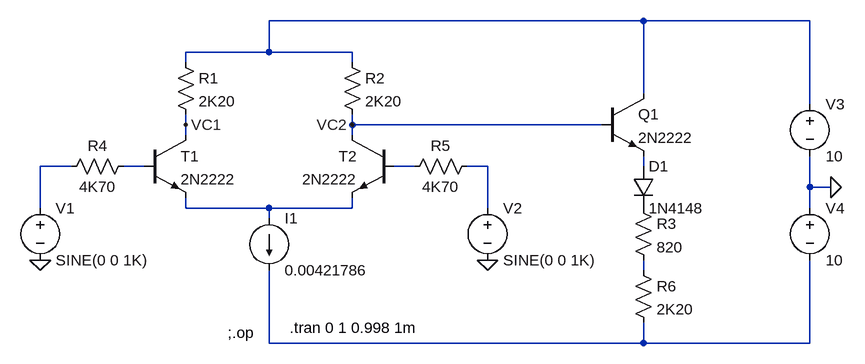
[diagram p0: schematic Prelab 2.asc]
Prelab 2.asc, the LTspice schematic file:
Version 4
SHEET 1 1144 680
WIRE 832 -48 256 -48
WIRE 1088 -48 832 -48
WIRE 256 0 256 -48
WIRE 256 0 128 0
WIRE 384 0 256 0
WIRE 128 16 128 0
WIRE 384 16 384 0
WIRE 832 64 832 -48
WIRE 1088 80 1088 -48
WIRE 128 112 128 96
WIRE 384 112 384 96
WIRE 768 112 384 112
WIRE 128 128 128 112
WIRE 384 128 384 112
WIRE -48 176 -96 176
WIRE 64 176 32 176
WIRE 480 176 448 176
WIRE 592 176 560 176
WIRE 832 176 832 160
WIRE 1088 208 1088 160
WIRE 1120 208 1088 208
WIRE -96 240 -96 176
WIRE 128 240 128 224
WIRE 256 240 128 240
WIRE 384 240 384 224
WIRE 384 240 256 240
WIRE 592 240 592 176
WIRE 1088 240 1088 208
WIRE 256 256 256 240
WIRE 832 336 832 320
WIRE 256 448 256 336
WIRE 832 448 832 416
WIRE 832 448 256 448
WIRE 1088 448 1088 320
WIRE 1088 448 832 448
FLAG -96 320 0
FLAG 592 320 0
FLAG 1120 208 0
FLAG 384 112 VC2
FLAG 128 112 VC1
SYMBOL res 112 0 R0
SYMATTR InstName R1
SYMATTR Value 2K20
SYMBOL res 368 0 R0
SYMATTR InstName R2
SYMATTR Value 2K20
SYMBOL res 48 160 R90
WINDOW 0 0 56 VBottom 2
WINDOW 3 32 56 VTop 2
SYMATTR InstName R4
SYMATTR Value 4K70
SYMBOL res 576 160 R90
WINDOW 0 0 56 VBottom 2
WINDOW 3 32 56 VTop 2
SYMATTR InstName R5
SYMATTR Value 4K70
SYMBOL npn 64 128 R0
SYMATTR InstName T1
SYMATTR Value 2N2222
SYMBOL npn 448 128 M0
SYMATTR InstName T2
SYMATTR Value 2N2222
SYMBOL voltage -96 224 R0
WINDOW 123 0 0 Left 0
WINDOW 39 0 0 Left 0
SYMATTR InstName V1
SYMATTR Value SINE(0 0 1K)
SYMBOL voltage 592 224 R0
WINDOW 123 0 0 Left 0
WINDOW 39 0 0 Left 0
SYMATTR InstName V2
SYMATTR Value SINE(0 0 1K)
SYMBOL voltage 1088 64 R0
WINDOW 123 0 0 Left 0
WINDOW 39 0 0 Left 0
SYMATTR InstName V3
SYMATTR Value 10
SYMBOL voltage 1088 224 R0
WINDOW 123 0 0 Left 0
WINDOW 39 0 0 Left 0
SYMATTR InstName V4
SYMATTR Value 10
SYMBOL current 256 256 R0
WINDOW 123 0 0 Left 0
WINDOW 39 0 0 Left 0
SYMATTR InstName I1
SYMATTR Value 0.00421786
SYMBOL npn 768 64 R0
SYMATTR InstName Q1
SYMATTR Value 2N2222
SYMBOL diode 816 176 R0
SYMATTR InstName D1
SYMATTR Value 1N4148
SYMBOL res 816 224 R0
SYMATTR InstName R3
SYMATTR Value 820
SYMBOL res 816 320 R0
SYMATTR InstName R6
SYMATTR Value 2K20
TEXT 192 432 Left 2 !;.op
TEXT 288 424 Left 2 !.tran 0 1 0.998 1m

The netlist it stands for:
* Prelab 2.asc
R1 N001 VC1 2K20
R2 N001 VC2 2K20
R4 N003 N002 4K70
R5 N005 N004 4K70
Q§T1 VC1 N003 N007 0 2N2222
Q§T2 VC2 N004 N007 0 2N2222
V1 N002 0 SINE(0 0 1K)
V2 N005 0 SINE(0 0 1K)
V3 N001 0 10
V4 0 N009 10
I1 N007 N009 0.00421786
Q1 N001 VC2 N006 0 2N2222
D1 N006 P001 1N4148
R3 P001 N008 820
R6 N008 N009 2K20
.model D D
.lib standard.dio
.model NPN NPN
.model PNP PNP
.lib standard.bjt
;.op
.tran 0 1 0.998 1m
.backanno
.end